# Altium schematic sheet 01_Main.SchDoc: Concentrator
size 594 x 420 mm; ApprovedBy: Ульянов А.В.; CheckedBy: Ульянов А.В.; Author: Ульянов А.В.; CompanyName: voidelectrics; DrawnBy: Ульянов А.В.; Engineer: Ульянов А.В.; Organization: voidelectrics; DocumentNumber: Concentrator; SheetNumber: 1; SheetTotal: 11
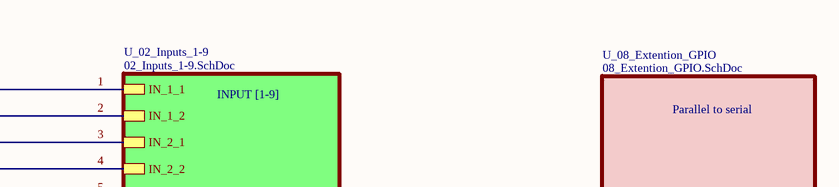
[diagram p0: 01_Main.SchDoc, top left]
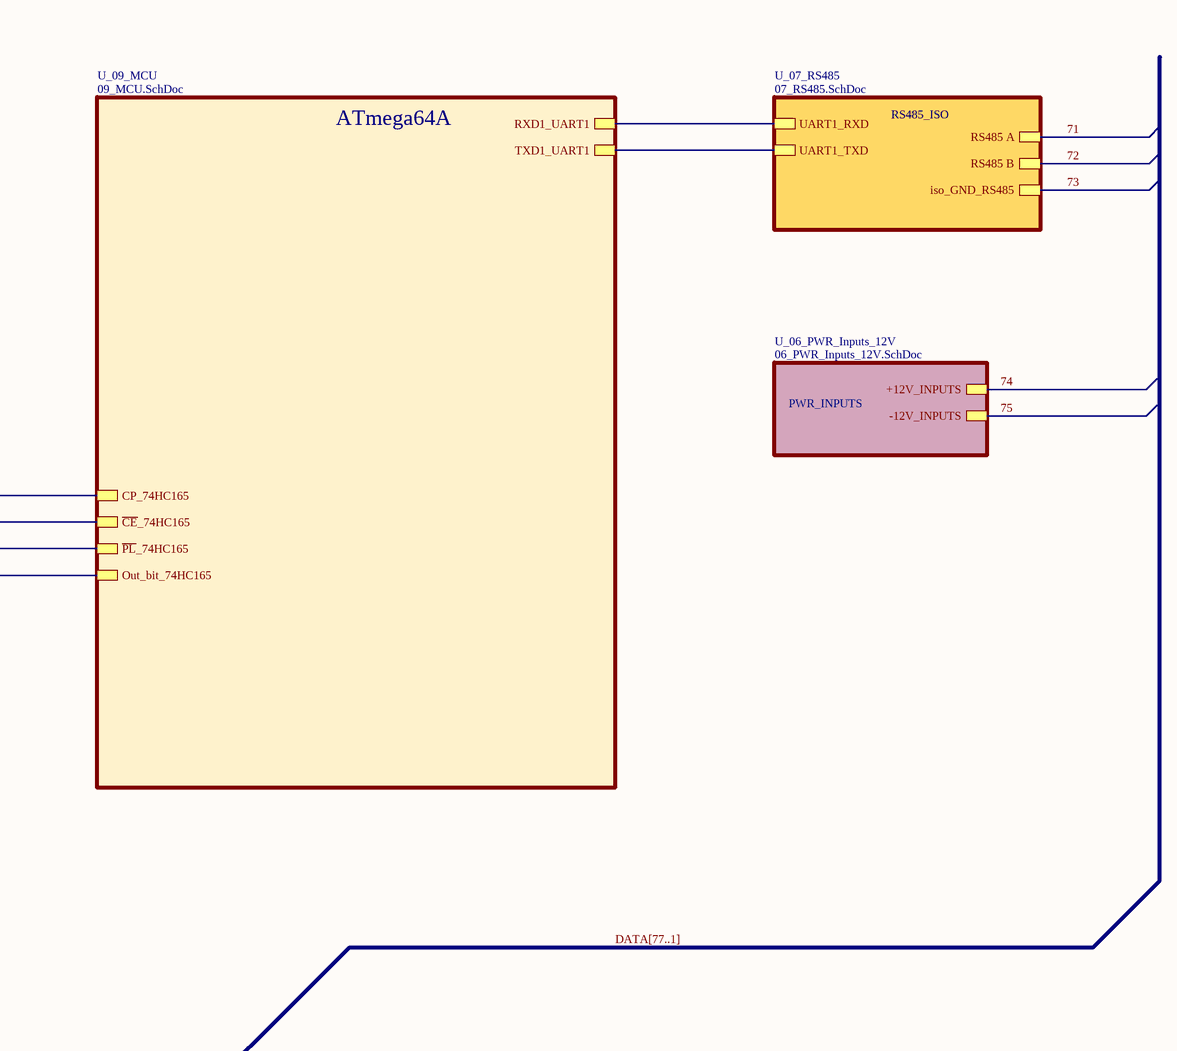
[diagram p1: 01_Main.SchDoc, top right]
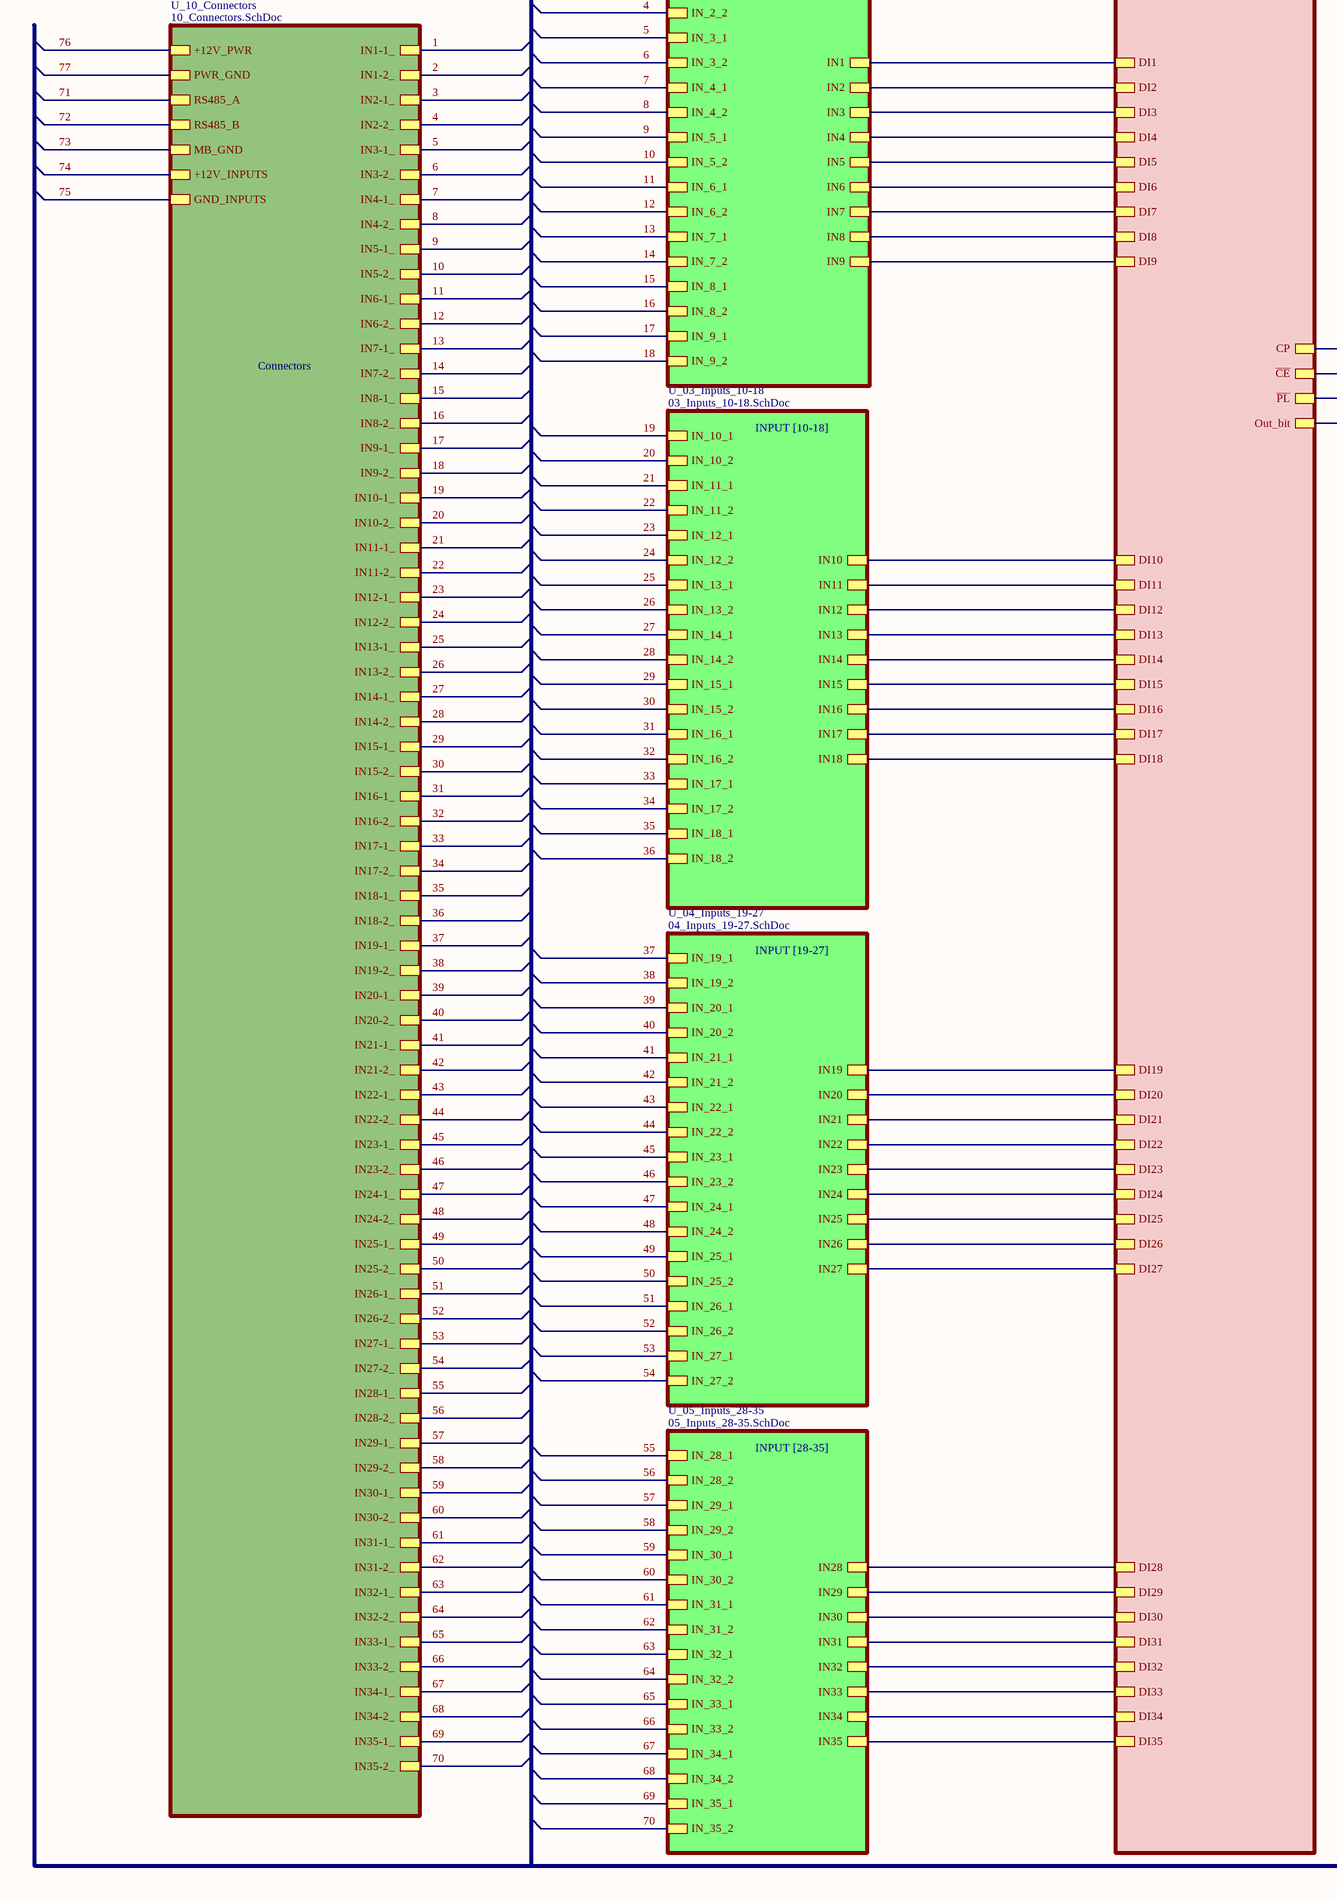
[diagram p2: 01_Main.SchDoc, bottom left]
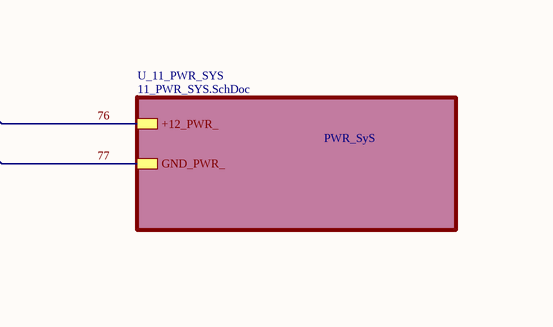
[diagram p3: 01_Main.SchDoc, bottom right]

## Sub-sheets
U_02_Inputs_1-9 = 02_Inputs_1-9.SchDoc: IN_1_2, IN_1_1, IN_2_2, IN_2_1, IN_3_2, IN_3_1, IN_4_2, IN_4_1, IN_5_2, IN_5_1, IN_6_2, IN_6_1, IN_7_2, IN_7_1, IN_8_2, IN_8_1, IN_9_2, IN_9_1, IN1, IN2, IN3, IN4, IN5, IN6, IN7, IN8, IN9
U_03_Inputs_10-18 = 03_Inputs_10-18.SchDoc: IN_18_2, IN_18_1, IN_10_2, IN_10_1, IN_11_2, IN_11_1, IN_12_2, IN_12_1, IN_13_2, IN_13_1, IN_14_2, IN_14_1, IN_15_2, IN_15_1, IN_16_2, IN_16_1, IN_17_2, IN_17_1, IN18, IN10, IN11, IN12, IN13, IN14, IN15, IN16, IN17
U_04_Inputs_19-27 = 04_Inputs_19-27.SchDoc: IN_19_2, IN_19_1, IN_20_2, IN_20_1, IN_21_2, IN_21_1, IN_22_2, IN_22_1, IN_23_2, IN_23_1, IN_24_2, IN_24_1, IN_25_2, IN_25_1, IN_26_2, IN_26_1, IN_27_2, IN_27_1, IN19, IN20, IN21, IN22, IN23, IN24, IN25, IN26, IN27
U_05_Inputs_28-35 = 05_Inputs_28-35.SchDoc: IN_28_2, IN_28_1, IN_29_2, IN_29_1, IN_30_2, IN_30_1, IN_31_2, IN_31_1, IN_32_2, IN_32_1, IN_33_2, IN_33_1, IN_34_2, IN_34_1, IN_35_2, IN_35_1, IN28, IN29, IN30, IN31, IN32, IN33, IN34, IN35
U_06_PWR_Inputs_12V = 06_PWR_Inputs_12V.SchDoc: +12V_INPUTS, -12V_INPUTS
U_07_RS485 = 07_RS485.SchDoc: UART1_RXD, UART1_TXD, RS485 B, RS485 A, iso_GND_RS485
U_08_Extention_GPIO = 08_Extention_GPIO.SchDoc: DI1, DI2, DI3, DI4, DI5, DI6, DI7, DI8, DI9, DI10, DI11, DI12, DI13, DI14, DI15, DI16, DI17, DI18, DI19, DI20, DI21, DI22, DI23, DI24, DI25, DI26, DI27, DI28, DI29, DI30, DI31, DI32, DI33, DI34, DI35, CP, ~{CE}, ~{PL}, Out_bit
U_09_MCU = 09_MCU.SchDoc: CP_74HC165, ~{CE}_74HC165, ~{PL}_74HC165, Out_bit_74HC165, RXD1_UART1, TXD1_UART1
U_10_Connectors = 10_Connectors.SchDoc: +12V_PWR, PWR_GND, RS485_A, RS485_B, MB_GND, +12V_INPUTS, GND_INPUTS, IN1-1_, IN1-2_, IN2-1_, IN2-2_, IN3-1_, IN3-2_, IN4-1_, IN4-2_, IN5-1_, IN5-2_, IN6-1_, IN6-2_, IN7-1_, IN7-2_, IN8-1_, IN8-2_, IN9-1_, IN9-2_, IN10-1_, IN10-2_, IN11-1_, IN11-2_, IN12-1_, IN12-2_, IN13-1_, IN13-2_, IN14-1_, IN14-2_, IN15-1_, IN15-2_, IN16-1_, IN16-2_, IN17-1_, IN17-2_, IN18-1_, IN18-2_, IN19-1_, IN19-2_, IN20-1_, IN20-2_, IN21-1_, IN21-2_, IN22-1_, IN22-2_, IN23-1_, IN23-2_, IN24-1_, IN24-2_, IN25-1_, IN25-2_, IN26-1_, IN26-2_, IN27-1_, IN27-2_, IN28-1_, IN28-2_, IN29-1_, IN29-2_, IN30-1_, IN30-2_, IN31-1_, IN31-2_, IN32-1_, IN32-2_, IN33-1_, IN33-2_, IN34-1_, IN34-2_, IN35-1_, IN35-2_
U_11_PWR_SYS = 11_PWR_SYS.SchDoc: +12_PWR_, GND_PWR_

## Nets
1: sheet U_02_Inputs_1-9/IN_1_1, sheet U_10_Connectors/IN1-1_
2: sheet U_02_Inputs_1-9/IN_1_2, sheet U_10_Connectors/IN1-2_
3: sheet U_02_Inputs_1-9/IN_2_1, sheet U_10_Connectors/IN2-1_
4: sheet U_02_Inputs_1-9/IN_2_2, sheet U_10_Connectors/IN2-2_
5: sheet U_02_Inputs_1-9/IN_3_1, sheet U_10_Connectors/IN3-1_
6: sheet U_02_Inputs_1-9/IN_3_2, sheet U_10_Connectors/IN3-2_
7: sheet U_02_Inputs_1-9/IN_4_1, sheet U_10_Connectors/IN4-1_
8: sheet U_02_Inputs_1-9/IN_4_2, sheet U_10_Connectors/IN4-2_
9: sheet U_02_Inputs_1-9/IN_5_1, sheet U_10_Connectors/IN5-1_
10: sheet U_02_Inputs_1-9/IN_5_2, sheet U_10_Connectors/IN5-2_
11: sheet U_02_Inputs_1-9/IN_6_1, sheet U_10_Connectors/IN6-1_
12: sheet U_02_Inputs_1-9/IN_6_2, sheet U_10_Connectors/IN6-2_
13: sheet U_02_Inputs_1-9/IN_7_1, sheet U_10_Connectors/IN7-1_
14: sheet U_02_Inputs_1-9/IN_7_2, sheet U_10_Connectors/IN7-2_
15: sheet U_02_Inputs_1-9/IN_8_1, sheet U_10_Connectors/IN8-1_
16: sheet U_02_Inputs_1-9/IN_8_2, sheet U_10_Connectors/IN8-2_
17: sheet U_02_Inputs_1-9/IN_9_1, sheet U_10_Connectors/IN9-1_
18: sheet U_02_Inputs_1-9/IN_9_2, sheet U_10_Connectors/IN9-2_
19: sheet U_03_Inputs_10-18/IN_10_1, sheet U_10_Connectors/IN10-1_
20: sheet U_03_Inputs_10-18/IN_10_2, sheet U_10_Connectors/IN10-2_
21: sheet U_03_Inputs_10-18/IN_11_1, sheet U_10_Connectors/IN11-1_
22: sheet U_03_Inputs_10-18/IN_11_2, sheet U_10_Connectors/IN11-2_
23: sheet U_03_Inputs_10-18/IN_12_1, sheet U_10_Connectors/IN12-1_
24: sheet U_03_Inputs_10-18/IN_12_2, sheet U_10_Connectors/IN12-2_
25: sheet U_03_Inputs_10-18/IN_13_1, sheet U_10_Connectors/IN13-1_
26: sheet U_03_Inputs_10-18/IN_13_2, sheet U_10_Connectors/IN13-2_
27: sheet U_03_Inputs_10-18/IN_14_1, sheet U_10_Connectors/IN14-1_
28: sheet U_03_Inputs_10-18/IN_14_2, sheet U_10_Connectors/IN14-2_
29: sheet U_03_Inputs_10-18/IN_15_1, sheet U_10_Connectors/IN15-1_
30: sheet U_03_Inputs_10-18/IN_15_2, sheet U_10_Connectors/IN15-2_
31: sheet U_03_Inputs_10-18/IN_16_1, sheet U_10_Connectors/IN16-1_
32: sheet U_03_Inputs_10-18/IN_16_2, sheet U_10_Connectors/IN16-2_
33: sheet U_03_Inputs_10-18/IN_17_1, sheet U_10_Connectors/IN17-1_
34: sheet U_03_Inputs_10-18/IN_17_2, sheet U_10_Connectors/IN17-2_
35: sheet U_03_Inputs_10-18/IN_18_1, sheet U_10_Connectors/IN18-1_
36: sheet U_03_Inputs_10-18/IN_18_2, sheet U_10_Connectors/IN18-2_
37: sheet U_04_Inputs_19-27/IN_19_1, sheet U_10_Connectors/IN19-1_
38: sheet U_04_Inputs_19-27/IN_19_2, sheet U_10_Connectors/IN19-2_
39: sheet U_04_Inputs_19-27/IN_20_1, sheet U_10_Connectors/IN20-1_
40: sheet U_04_Inputs_19-27/IN_20_2, sheet U_10_Connectors/IN20-2_
41: sheet U_04_Inputs_19-27/IN_21_1, sheet U_10_Connectors/IN21-1_
42: sheet U_04_Inputs_19-27/IN_21_2, sheet U_10_Connectors/IN21-2_
43: sheet U_04_Inputs_19-27/IN_22_1, sheet U_10_Connectors/IN22-1_
44: sheet U_04_Inputs_19-27/IN_22_2, sheet U_10_Connectors/IN22-2_
45: sheet U_04_Inputs_19-27/IN_23_1, sheet U_10_Connectors/IN23-1_
46: sheet U_04_Inputs_19-27/IN_23_2, sheet U_10_Connectors/IN23-2_
47: sheet U_04_Inputs_19-27/IN_24_1, sheet U_10_Connectors/IN24-1_
48: sheet U_04_Inputs_19-27/IN_24_2, sheet U_10_Connectors/IN24-2_
49: sheet U_04_Inputs_19-27/IN_25_1, sheet U_10_Connectors/IN25-1_
50: sheet U_04_Inputs_19-27/IN_25_2, sheet U_10_Connectors/IN25-2_
51: sheet U_04_Inputs_19-27/IN_26_1, sheet U_10_Connectors/IN26-1_
52: sheet U_04_Inputs_19-27/IN_26_2, sheet U_10_Connectors/IN26-2_
53: sheet U_04_Inputs_19-27/IN_27_1, sheet U_10_Connectors/IN27-1_
54: sheet U_04_Inputs_19-27/IN_27_2, sheet U_10_Connectors/IN27-2_
55: sheet U_05_Inputs_28-35/IN_28_1, sheet U_10_Connectors/IN28-1_
56: sheet U_05_Inputs_28-35/IN_28_2, sheet U_10_Connectors/IN28-2_
57: sheet U_05_Inputs_28-35/IN_29_1, sheet U_10_Connectors/IN29-1_
58: sheet U_05_Inputs_28-35/IN_29_2, sheet U_10_Connectors/IN29-2_
59: sheet U_05_Inputs_28-35/IN_30_1, sheet U_10_Connectors/IN30-1_
60: sheet U_05_Inputs_28-35/IN_30_2, sheet U_10_Connectors/IN30-2_
61: sheet U_05_Inputs_28-35/IN_31_1, sheet U_10_Connectors/IN31-1_
62: sheet U_05_Inputs_28-35/IN_31_2, sheet U_10_Connectors/IN31-2_
63: sheet U_05_Inputs_28-35/IN_32_1, sheet U_10_Connectors/IN32-1_
64: sheet U_05_Inputs_28-35/IN_32_2, sheet U_10_Connectors/IN32-2_
65: sheet U_05_Inputs_28-35/IN_33_1, sheet U_10_Connectors/IN33-1_
66: sheet U_05_Inputs_28-35/IN_33_2, sheet U_10_Connectors/IN33-2_
67: sheet U_05_Inputs_28-35/IN_34_1, sheet U_10_Connectors/IN34-1_
68: sheet U_05_Inputs_28-35/IN_34_2, sheet U_10_Connectors/IN34-2_
69: sheet U_05_Inputs_28-35/IN_35_1, sheet U_10_Connectors/IN35-1_
70: sheet U_05_Inputs_28-35/IN_35_2, sheet U_10_Connectors/IN35-2_
71: sheet U_07_RS485/RS485 A, sheet U_10_Connectors/RS485_A
72: sheet U_07_RS485/RS485 B, sheet U_10_Connectors/RS485_B
73: sheet U_07_RS485/iso_GND_RS485, sheet U_10_Connectors/MB_GND
74: sheet U_06_PWR_Inputs_12V/+12V_INPUTS, sheet U_10_Connectors/+12V_INPUTS
75: sheet U_06_PWR_Inputs_12V/-12V_INPUTS, sheet U_10_Connectors/GND_INPUTS
76: sheet U_10_Connectors/+12V_PWR, sheet U_11_PWR_SYS/+12_PWR_
77: sheet U_10_Connectors/PWR_GND, sheet U_11_PWR_SYS/GND_PWR_
(unnamed): sheet U_02_Inputs_1-9/IN1, sheet U_08_Extention_GPIO/DI1
(unnamed): sheet U_02_Inputs_1-9/IN2, sheet U_08_Extention_GPIO/DI2
(unnamed): sheet U_02_Inputs_1-9/IN3, sheet U_08_Extention_GPIO/DI3
(unnamed): sheet U_02_Inputs_1-9/IN4, sheet U_08_Extention_GPIO/DI4
(unnamed): sheet U_02_Inputs_1-9/IN5, sheet U_08_Extention_GPIO/DI5
(unnamed): sheet U_02_Inputs_1-9/IN6, sheet U_08_Extention_GPIO/DI6
(unnamed): sheet U_02_Inputs_1-9/IN7, sheet U_08_Extention_GPIO/DI7
(unnamed): sheet U_02_Inputs_1-9/IN8, sheet U_08_Extention_GPIO/DI8
(unnamed): sheet U_02_Inputs_1-9/IN9, sheet U_08_Extention_GPIO/DI9
(unnamed): sheet U_03_Inputs_10-18/IN18, sheet U_08_Extention_GPIO/DI18
(unnamed): sheet U_03_Inputs_10-18/IN10, sheet U_08_Extention_GPIO/DI10
(unnamed): sheet U_03_Inputs_10-18/IN11, sheet U_08_Extention_GPIO/DI11
(unnamed): sheet U_03_Inputs_10-18/IN12, sheet U_08_Extention_GPIO/DI12
(unnamed): sheet U_03_Inputs_10-18/IN13, sheet U_08_Extention_GPIO/DI13
(unnamed): sheet U_03_Inputs_10-18/IN14, sheet U_08_Extention_GPIO/DI14
(unnamed): sheet U_03_Inputs_10-18/IN15, sheet U_08_Extention_GPIO/DI15
(unnamed): sheet U_03_Inputs_10-18/IN16, sheet U_08_Extention_GPIO/DI16
(unnamed): sheet U_03_Inputs_10-18/IN17, sheet U_08_Extention_GPIO/DI17
(unnamed): sheet U_04_Inputs_19-27/IN19, sheet U_08_Extention_GPIO/DI19
(unnamed): sheet U_04_Inputs_19-27/IN20, sheet U_08_Extention_GPIO/DI20
(unnamed): sheet U_04_Inputs_19-27/IN21, sheet U_08_Extention_GPIO/DI21
(unnamed): sheet U_04_Inputs_19-27/IN22, sheet U_08_Extention_GPIO/DI22
(unnamed): sheet U_04_Inputs_19-27/IN23, sheet U_08_Extention_GPIO/DI23
(unnamed): sheet U_04_Inputs_19-27/IN24, sheet U_08_Extention_GPIO/DI24
(unnamed): sheet U_04_Inputs_19-27/IN25, sheet U_08_Extention_GPIO/DI25
(unnamed): sheet U_04_Inputs_19-27/IN26, sheet U_08_Extention_GPIO/DI26
(unnamed): sheet U_04_Inputs_19-27/IN27, sheet U_08_Extention_GPIO/DI27
(unnamed): sheet U_05_Inputs_28-35/IN28, sheet U_08_Extention_GPIO/DI28
(unnamed): sheet U_05_Inputs_28-35/IN29, sheet U_08_Extention_GPIO/DI29
(unnamed): sheet U_05_Inputs_28-35/IN30, sheet U_08_Extention_GPIO/DI30
(unnamed): sheet U_05_Inputs_28-35/IN31, sheet U_08_Extention_GPIO/DI31
(unnamed): sheet U_05_Inputs_28-35/IN32, sheet U_08_Extention_GPIO/DI32
(unnamed): sheet U_05_Inputs_28-35/IN33, sheet U_08_Extention_GPIO/DI33
(unnamed): sheet U_05_Inputs_28-35/IN34, sheet U_08_Extention_GPIO/DI34
(unnamed): sheet U_05_Inputs_28-35/IN35, sheet U_08_Extention_GPIO/DI35
(unnamed): sheet U_07_RS485/UART1_RXD, sheet U_09_MCU/RXD1_UART1
(unnamed): sheet U_07_RS485/UART1_TXD, sheet U_09_MCU/TXD1_UART1
(unnamed): sheet U_08_Extention_GPIO/CP, sheet U_09_MCU/CP_74HC165
(unnamed): sheet U_08_Extention_GPIO/~{CE}, sheet U_09_MCU/~{CE}_74HC165
(unnamed): sheet U_08_Extention_GPIO/~{PL}, sheet U_09_MCU/~{PL}_74HC165
(unnamed): sheet U_08_Extention_GPIO/Out_bit, sheet U_09_MCU/Out_bit_74HC165

## Buses and harness runs
bus DATA[77..1]

## Notes on the sheet
- INPUT [1-9]
- Parallel to serial
- ATmega64A
- RS485_ISO
- PWR_INPUTS
- Connectors
- INPUT [10-18]
- INPUT [19-27]
- PWR_SyS
- INPUT [28-35]
- Перв. примен.
- Справ. №
- Подп. и дата
- Инв. № дубл.
- Взам. инв. №
- Разраб.
- Изм.
- Лист
- № докум.
- Подп.
- Дата
- Лит.
- Масса
- Масштаб
- Пров.
- Т.контр.
- Листов
- Инв. № подл.
- Утв.
- Н.контр.
- 2.106-A2
- Копировал
- Формат А2